# EAGLE design ife_19_TS_BMS_Testing (EAGLE 9.2.0)

## Sheet 1 of 5: Power
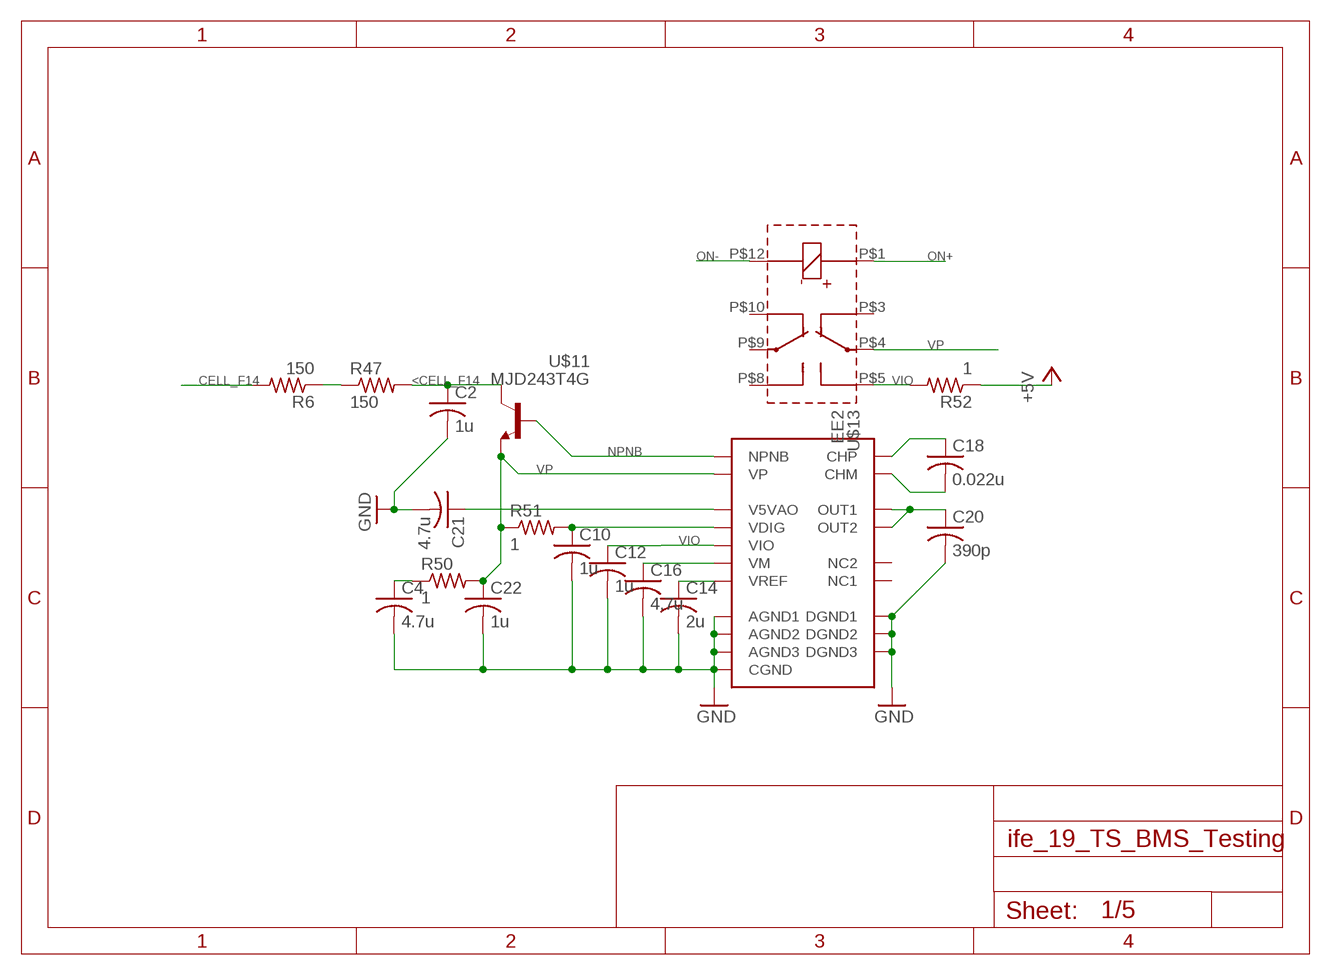
[diagram p0: schematic, sheet 1]

### Parts
C2  1u  C-USC0805  [C0805]
C4  4.7u  C-USC0805  [C0805]
C10  1u  C-USC0805  [C0805]
C12  1u  C-USC0805  [C0805]
C14  2u  C-USC0805  [C0805]
C16  4.7u  C-USC0805  [C0805]
C18  0.022u  C-USC0805  [C0805]
C20  390p  C-USC0805  [C0805]
C21  4.7u  C-USC0805  [C0805]
C22  1u  C-USC0805  [C0805]
R6  150  R-US_R2512  [R2512]
R47  150  R-US_R2512  [R2512]
R50  1  R-US_R0805  [R0805]
R51  1  R-US_R0805  [R0805]
R52  1  R-US_R0805  [R0805]
U$1  BQ76PL455A  [TQFP80]
U$11  MJD243T4G  [TO252]
U$13  EE2  [EE2-DPDT-SMD]

### Nets
<CELL_F14: C2.1 R47.2 U$11.4(C)
CELL_F14: R6.2 ; also sheet 2,5
GND: C2.2 C4.2 C10.2 C12.2 C14.2 C16.2 C20.2 C21.2 C22.2 U$1.30(DGND1) U$1.35(DGND2) U$1.37(DGND3) U$1.48(CGND) U$1.69(AGND3) U$1.72(AGND2) U$1.74(AGND1) ; also sheet 2,3,4,5
N$27: C4.1 R50.1
N$31: C10.1 R51.2 U$1.34(VDIG)
N$33: R52.2 U$13.P$5($P5)
N$35: C14.1 U$1.67(VREF)
N$37: C16.1 U$1.31(VM)
N$39: C21.1 U$1.58(V5VAO)
N$42: R6.1 R47.1
N$45: C18.1 U$1.32(CHP)
N$62: C18.2 U$1.33(CHM)
N$63: C20.1 U$1.68(OUT2) U$1.73(OUT1)
NPNB: U$1.71(NPNB) U$11.1(B)
ON+: U$13.P$1($P1) ; also sheet 3
ON-: U$13.P$12($P12) ; also sheet 3
VIO: C12.1 R52.1 U$1.41(VIO) ; supply symbol labelled +5V ; also sheet 4,5
VP: C22.1 R50.2 R51.1 U$1.70(VP) U$11.3(E) U$13.P$4($P4)
Unconnected: U$1.36(NC1) U$1.75(NC2) U$13.P$3($P3) U$13.P$8($P8) U$13.P$9($P9) U$13.P$10($P10)

## Sheet 2 of 5: Cells
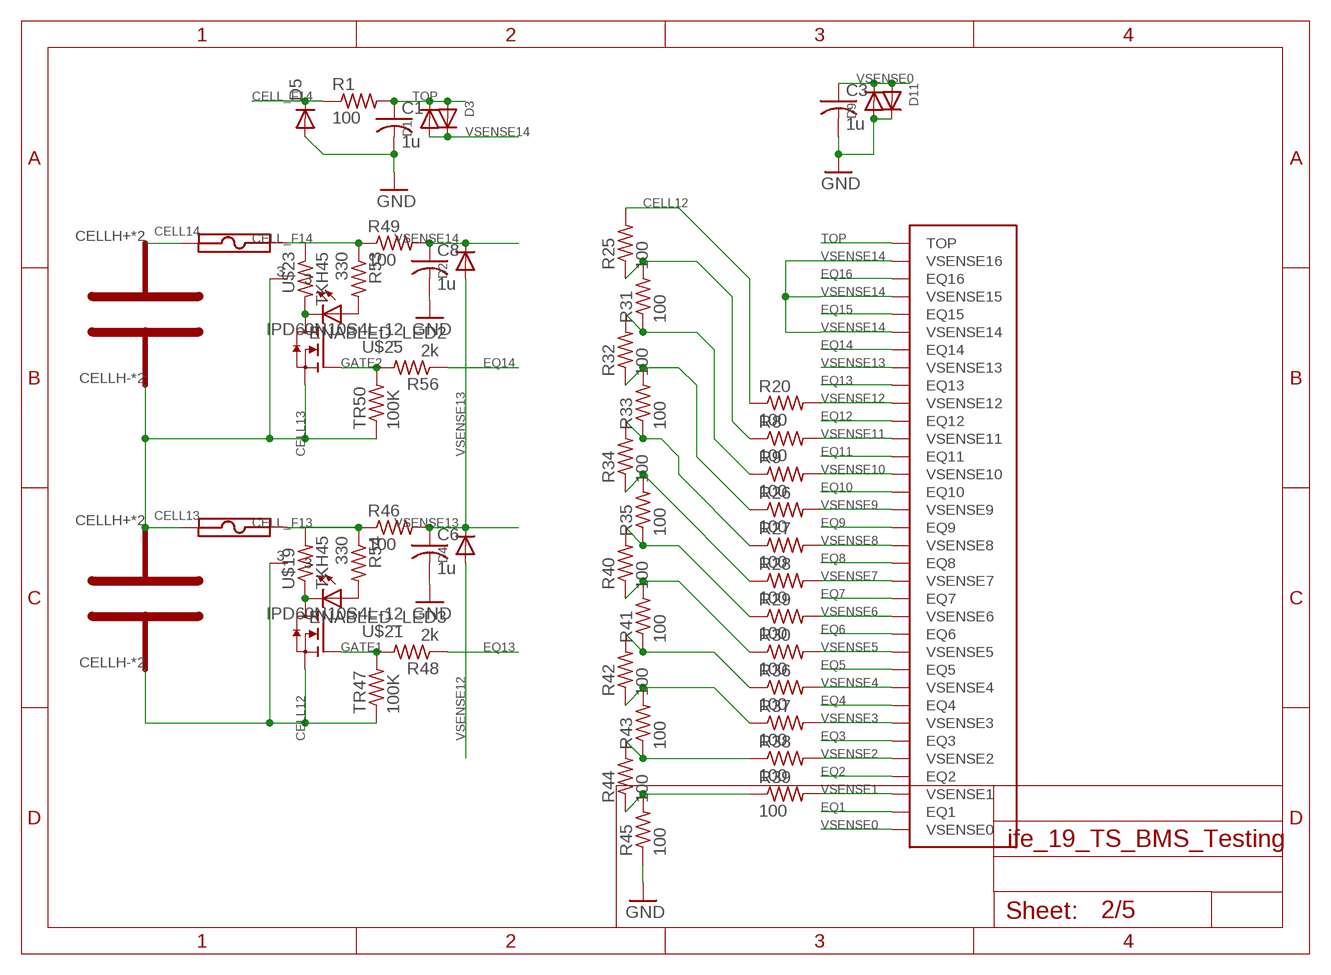
[diagram p1: schematic, sheet 2]

### Parts
13  LI6PT  [6PT]
14  LI6PT  [6PT]
C1  1u  C-USC0603K  [C0603K]
C3  1u  C-USC0603K  [C0603K]
C6  1u  C-USC0603K  [C0603K]
C8  1u  C-USC0603K  [C0603K]
D1  DIODESOD-123  [SOD-123]
D2  DIODESOD-123  [SOD-123]
D3  DIODESOD-123  [SOD-123]
D4  DIODESOD-123  [SOD-123]
D5  DIODE-DO214AC  [DO214AC]
D9  DIODESOD-123  [SOD-123]
D11  DIODESOD-123  [SOD-123]
ENABLED_LED2  LEDCHIPLED_0603  [CHIPLED_0603]
ENABLED_LED3  LEDCHIPLED_0603  [CHIPLED_0603]
R1  100  R-US_R0603  [R0603]
R8  100  R-US_R0603  [R0603]
R9  100  R-US_R0603  [R0603]
R20  100  R-US_R0603  [R0603]
R25  100  R-US_R0603  [R0603]
R26  100  R-US_R0603  [R0603]
R27  100  R-US_R0603  [R0603]
R28  100  R-US_R0603  [R0603]
R29  100  R-US_R0603  [R0603]
R30  100  R-US_R0603  [R0603]
R31  100  R-US_R0603  [R0603]
R32  100  R-US_R0603  [R0603]
R33  100  R-US_R0603  [R0603]
R34  100  R-US_R0603  [R0603]
R35  100  R-US_R0603  [R0603]
R36  100  R-US_R0603  [R0603]
R37  100  R-US_R0603  [R0603]
R38  100  R-US_R0603  [R0603]
R39  100  R-US_R0603  [R0603]
R40  100  R-US_R0603  [R0603]
R41  100  R-US_R0603  [R0603]
R42  100  R-US_R0603  [R0603]
R43  100  R-US_R0603  [R0603]
R44  100  R-US_R0603  [R0603]
R45  100  R-US_R0603  [R0603]
R46  100  R-US_R0603  [R0603]
R48  2k  R-US_R0603  [R0603]
R49  100  R-US_R0603  [R0603]
R53  330  R-US_R0603  [R0603]
R54  330  R-US_R0603  [R0603]
R56  2k  R-US_R0603  [R0603]
TR47  100K  R-US_R0603  [R0603]
TR50  100K  R-US_R0603  [R0603]
U$18  SF-0603FP  [0603]
U$19  TKH45  [TO252-TKH-45]
U$21  IPD60N10S4L-12  [TO252]
U$22  SF-0603FP  [0603]
U$23  TKH45  [TO252-TKH-45]
U$25  IPD60N10S4L-12  [TO252]

### Nets
CELL12: 13.CELLH-(CELL-) 13.CELLP-(CELL-) R20.1 R25.2 TR47.1 U$19.3 U$21.3(S) ; also sheet 4
CELL13: 13.CELLH+(CELL+) 13.CELLP+(CELL+) 14.CELLH-(CELL-) 14.CELLP-(CELL-) TR50.1 U$18.1 U$23.3 U$25.3(S)
CELL14: 14.CELLH+(CELL+) 14.CELLP+(CELL+) U$22.1
CELL_F13: R46.1 R54.1 U$18.2 U$19.2 ; also sheet 5
CELL_F14: D5.C R1.1 R49.1 R53.1 U$22.2 U$23.1 ; also sheet 1,5
EQ1: U$1.28(EQ1)
EQ2: U$1.26(EQ2)
EQ3: U$1.24(EQ3)
EQ4: U$1.22(EQ4)
EQ5: U$1.20(EQ5)
EQ6: U$1.18(EQ6)
EQ7: U$1.16(EQ7)
EQ8: U$1.14(EQ8)
EQ9: U$1.12(EQ9)
EQ10: U$1.10(EQ10)
EQ11: U$1.8(EQ11)
EQ12: U$1.6(EQ12)
EQ13: R48.1 U$1.4(EQ13)
EQ14: R56.1 U$1.2(EQ14)
EQ15: U$1.80(EQ15)
EQ16: U$1.78(EQ16)
GATE1: R48.2 TR47.2 U$21.1(G)
GATE2: R56.2 TR50.2 U$25.1(G)
GND: C1.2 C3.2 C6.2 C8.2 D5.A D9.A D11.C R45.1 ; also sheet 1,3,4,5
N$29: ENABLED_LED2.A R53.2
N$30: ENABLED_LED3.A R54.2
N$38: ENABLED_LED3.C U$19.1 U$21.2(D)
N$41: ENABLED_LED2.C U$23.2 U$25.2(D)
N$51: R8.1 R25.1 R31.2
N$52: R9.1 R31.1 R32.2
N$53: R26.1 R32.1 R33.2
N$54: R27.1 R33.1 R34.2
N$55: R28.1 R34.1 R35.2
N$56: R29.1 R35.1 R40.2
N$57: R30.1 R40.1 R41.2
N$58: R36.1 R41.1 R42.2
N$59: R37.1 R42.1 R43.2
N$60: R38.1 R43.1 R44.2
N$61: R39.1 R44.1 R45.2
TOP: C1.1 D1.C D3.A R1.2 U$1.76(TOP)
VSENSE0: C3.1 D9.C D11.A U$1.29(VSENSE0)
VSENSE1: R39.2 U$1.27(VSENSE1)
VSENSE2: R38.2 U$1.25(VSENSE2)
VSENSE3: R37.2 U$1.23(VSENSE3)
VSENSE4: R36.2 U$1.21(VSENSE4)
VSENSE5: R30.2 U$1.19(VSENSE5)
VSENSE6: R29.2 U$1.17(VSENSE6)
VSENSE7: R28.2 U$1.15(VSENSE7)
VSENSE8: R27.2 U$1.13(VSENSE8)
VSENSE9: R26.2 U$1.11(VSENSE9)
VSENSE10: R9.2 U$1.9(VSENSE10)
VSENSE11: R8.2 U$1.7(VSENSE11)
VSENSE12: D4.A R20.2 U$1.5(VSENSE12)
VSENSE13: C6.1 D2.A D4.C R46.2 U$1.3(VSENSE13)
VSENSE14: C8.1 D1.A D2.C D3.C R49.2 U$1.1(VSENSE14) U$1.77(VSENSE16) U$1.79(VSENSE15)

## Sheet 3 of 5: Differential communication
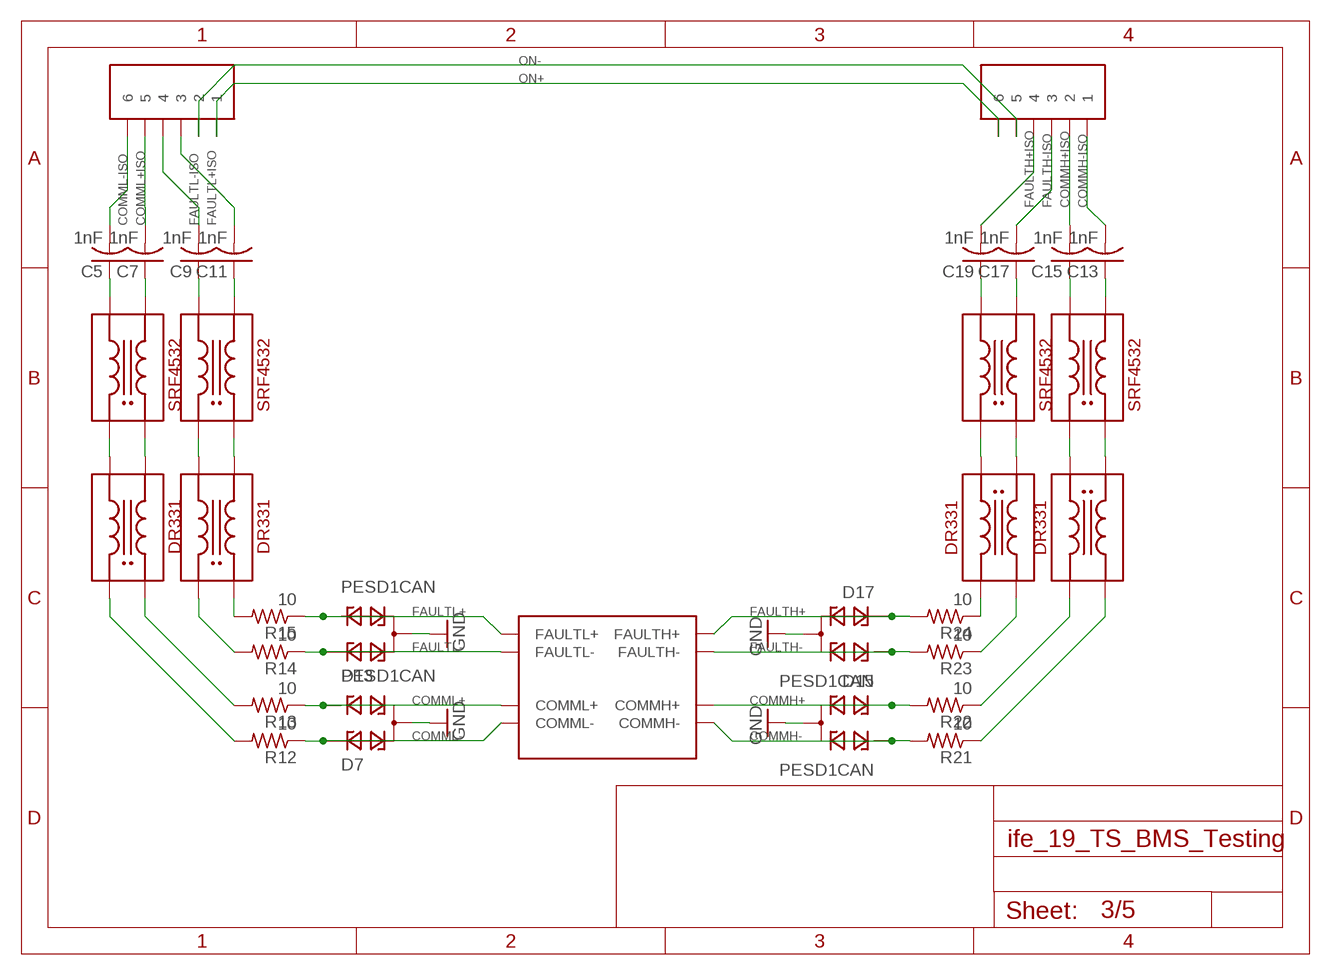
[diagram p2: schematic, sheet 3]

### Parts
C5  1nF  C-USC0805  [C0805]
C7  1nF  C-USC0805  [C0805]
C9  1nF  C-USC0805  [C0805]
C11  1nF  C-USC0805  [C0805]
C13  1nF  C-USC0805  [C0805]
C15  1nF  C-USC0805  [C0805]
C17  1nF  C-USC0805  [C0805]
C19  1nF  C-USC0805  [C0805]
D7  PESD1CAN  [SOT23]
D13  PESD1CAN  [SOT23]
D15  PESD1CAN  [SOT23]
D17  PESD1CAN  [SOT23]
R12  10  R-US_R0805  [R0805]
R13  10  R-US_R0805  [R0805]
R14  10  R-US_R0805  [R0805]
R15  10  R-US_R0805  [R0805]
R21  10  R-US_R0805  [R0805]
R22  10  R-US_R0805  [R0805]
R23  10  R-US_R0805  [R0805]
R24  10  R-US_R0805  [R0805]
U$2  SRF5432  [SRF5432]
U$3  SRF5432  [SRF5432]
U$4  SRF5432  [SRF5432]
U$5  MICROFIT3.0-3P  [6POS-3MM]
U$6  SRF5432  [SRF5432]
U$7  MICROFIT3.0-3P  [6POS-3MM]
U$10  DR331  [DR331]
U$12  DR331  [DR331]
U$14  DR331  [DR331]
U$16  DR331  [DR331]

### Nets
COMMH+: D15.1 R22.2 U$1.55(COMMH+)
COMMH+ISO: C15.2 U$7.P$2
COMMH-: D15.2 R21.2 U$1.54(COMMH-)
COMMH-ISO: C13.2 U$7.P$1
COMML+: D7.2 R13.1 U$1.52(COMML+)
COMML+ISO: C7.2 U$5.P$5
COMML-: D7.1 R12.1 U$1.53(COMML-)
COMML-ISO: C5.2 U$5.P$6
FAULTH+: D17.1 R24.2 U$1.57(FAULTH+)
FAULTH+ISO: C19.2 U$7.P$4
FAULTH-: D17.2 R23.2 U$1.56(FAULTH-)
FAULTH-ISO: C17.2 U$7.P$3
FAULTL+: D13.2 R15.1 U$1.50(FAULTL+)
FAULTL+ISO: C11.2 U$5.P$3
FAULTL-: D13.1 R14.1 U$1.51(FAULTL-)
FAULTL-ISO: C9.2 U$5.P$4
GND: D7.3 D13.3 D15.3 D17.3 ; also sheet 1,2,4,5
N$1: C5.1 U$2.P$3
N$2: C7.1 U$2.P$2
N$3: C9.1 U$3.P$3
N$4: C11.1 U$3.P$2
N$7: C13.1 U$6.P$2
N$8: C15.1 U$6.P$3
N$9: C17.1 U$4.P$2
N$10: C19.1 U$4.P$3
N$11: U$6.P$4 U$14.P$2
N$12: U$6.P$1 U$14.P$1
N$13: U$4.P$4 U$16.P$2
N$14: U$4.P$1 U$16.P$1
N$15: U$2.P$1 U$10.P$3
N$16: U$2.P$4 U$10.P$4
N$17: U$3.P$1 U$12.P$3
N$18: U$3.P$4 U$12.P$4
N$19: R14.2 U$12.P$1
N$20: R13.2 U$10.P$2
N$21: R12.2 U$10.P$1
N$22: R15.2 U$12.P$2
N$23: R23.1 U$16.P$4
N$24: R22.1 U$14.P$3
N$25: R21.1 U$14.P$4
N$26: R24.1 U$16.P$3
ON+: U$5.P$1 U$7.P$6 ; also sheet 1
ON-: U$5.P$2 U$7.P$5 ; also sheet 1

## Sheet 4 of 5: Communication
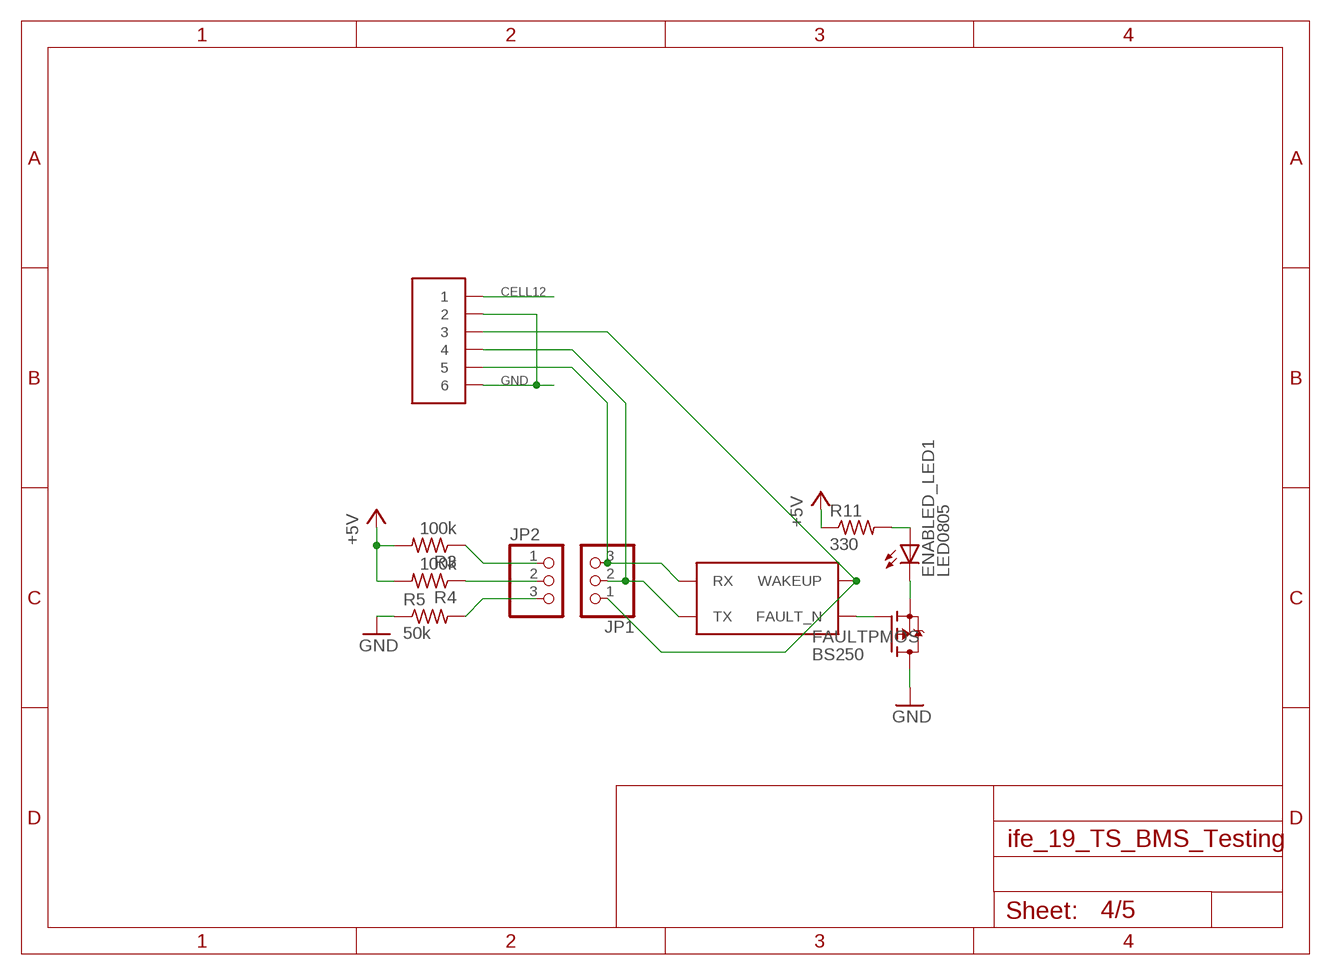
[diagram p3: schematic, sheet 4]

### Parts
ENABLED_LED1  LED0805  [LED0805]
FAULTPMOS  BS250  [SOT23]
JP1  PINHD-1X3CB  [1X03-CLEANBIG]
JP2  PINHD-1X3CB  [1X03-CLEANBIG]
R3  100k  R-US_R0805  [R0805]
R4  100k  R-US_R0805  [R0805]
R5  50k  R-US_R0805  [R0805]
R11  330  R-US_R0805  [R0805]
U$9  MICROFIT3.0-3P  [6POS-3MM]

### Nets
CELL12: U$9.P$1 ; also sheet 2
FAULT_N: FAULTPMOS.1(G) U$1.40(FAULT_N)
GND: FAULTPMOS.3(D) R5.1 U$9.P$2 U$9.P$6 ; also sheet 1,2,3,5
N$5: ENABLED_LED1.2(C) FAULTPMOS.2(S)
N$6: ENABLED_LED1.1(A) R11.2
N$28: JP2.1 R3.1
N$34: JP1.3 U$1.39(RX) U$9.P$5
N$40: JP2.2 R4.1
N$43: JP2.3 R5.2
N$44: JP1.2 U$1.38(TX) U$9.P$4
N$46: JP1.1 U$1.49(WAKEUP) U$9.P$3
VIO: R3.2 R4.2 R11.1 ; supply symbol labelled +5V ; also sheet 1,5

## Sheet 5 of 5: GPIO
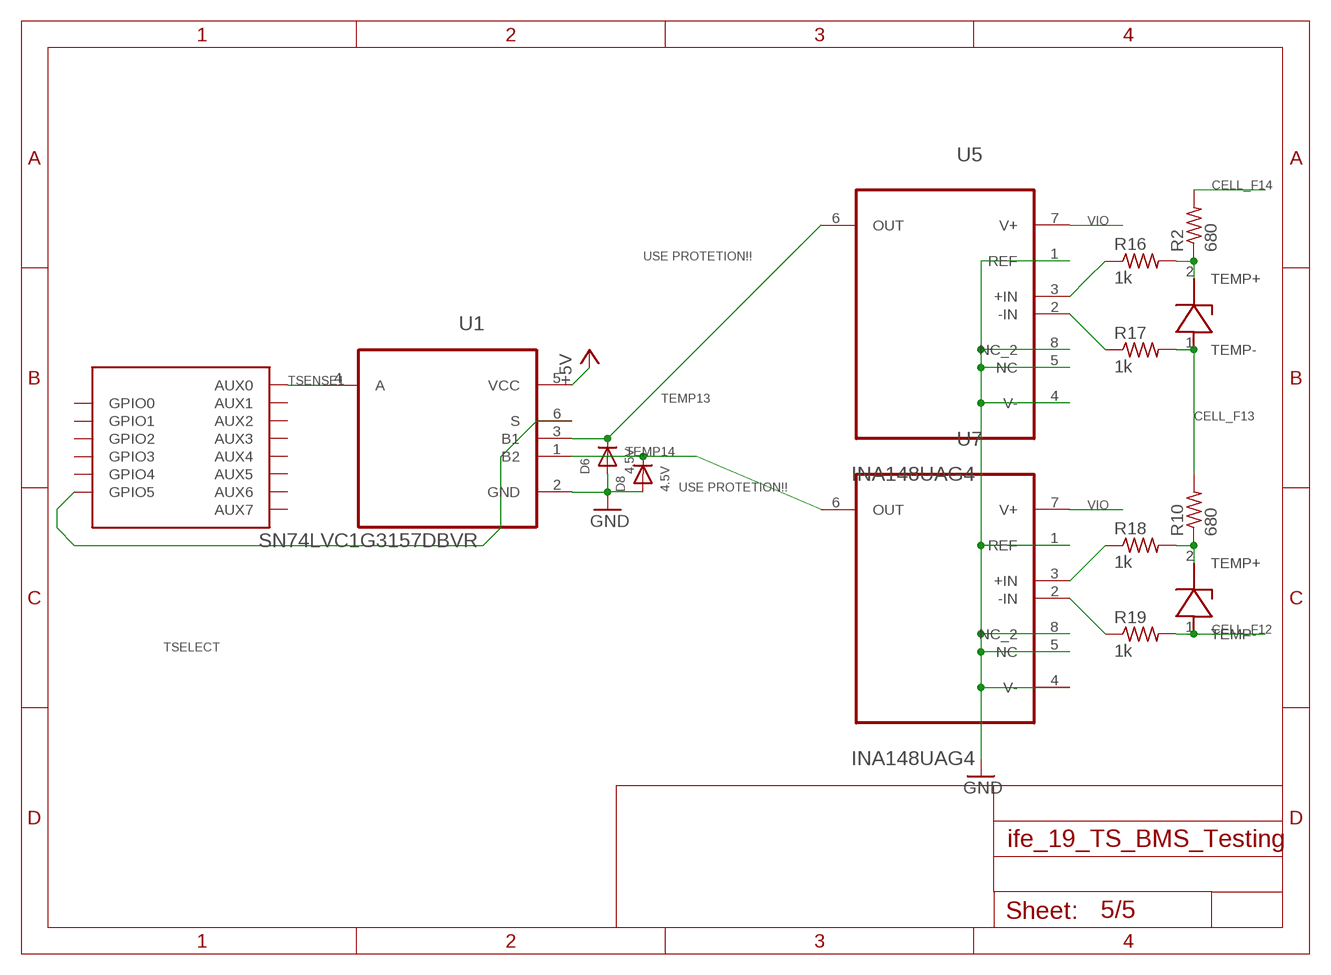
[diagram p4: schematic, sheet 5]

### Parts
D6  4.5V  DIODESOD-123  [SOD-123]
D8  4.5V  DIODESOD-123  [SOD-123]
R2  680  R-US_R0603  [R0603]
R10  680  R-US_R0603  [R0603]
R16  1k  R-US_R0603  [R0603]
R17  1k  R-US_R0603  [R0603]
R18  1k  R-US_R0603  [R0603]
R19  1k  R-US_R0603  [R0603]
U1  SN74LVC1G3157DBVR  [SOT95P280X145-6N]
U5  INA148UAG4  [SOIC127P600X175-8N]
U7  INA148UAG4  [SOIC127P600X175-8N]

### Nets
CELL_F12: 13.1(TEMP-) R19.2
CELL_F13: 14.1(TEMP-) R10.2 R17.2 ; also sheet 2
CELL_F14: R2.2 ; also sheet 1,2
GND: D6.A D8.A U1.2(GND) U5.1(REF) U5.4(V-) U5.5(NC) U5.8(NC_2) U7.1(REF) U7.4(V-) U7.5(NC) U7.8(NC_2) ; also sheet 1,2,3,4
N$32: R16.1 U5.3(+IN)
N$36: R18.1 U7.3(+IN)
N$47: R17.1 U5.2(-IN)
N$48: 14.2(TEMP+) R2.1 R16.2
N$49: 13.2(TEMP+) R10.1 R18.2
N$50: R19.1 U7.2(-IN)
TEMP13: D6.C U1.3(B1) U5.6(OUT)
TEMP14: D8.C U1.1(B2) U7.6(OUT)
TSELECT: U1.6(S) U$1.42(GPIO5)
TSENSE1: U1.4(A) U$1.66(AUX0)
VIO: U1.5(VCC) U5.7(V+) U7.7(V+) ; supply symbol labelled +5V ; also sheet 1,4
Unconnected: U$1.43(GPIO4) U$1.44(GPIO3) U$1.45(GPIO2) U$1.46(GPIO1) U$1.47(GPIO0) U$1.59(AUX7) U$1.60(AUX6) U$1.61(AUX5) U$1.62(AUX4) U$1.63(AUX3) U$1.64(AUX2) U$1.65(AUX1)

### Notes on the sheet
- USE PROTETION!!
- USE PROTETION!!

## Library data of the parts
13 14 = IFE_Energus:LI6PT
C1-C22 = rcl:C-US: CAPACITOR, American symbol; SPICEPREFIX: C
D1-D4 D6 D8 D9 D11 = adafruit:DIODE: Diode SMADIODE - SMA Surface Mount Package 20V 1A Schottky Diode Digikey: 641-1014-6-ND DO-1N4148 - Through Hole Small Current Diode SOD-123 20V 1 A (.5mV Vf) Schottky Diode - Digikey: MBRX120TPMSCT-ND SOD-323 10V 570mA (.38mV Vf, 3ns) Schottky Diode - Digikey: ZLLS410CT-ND SOD-523 30V 30mA Schottky Diode (RB751S-40TE61) - Digikey: RB751S-40TE61CT-ND SOT23-R/W - SOT23 Package (R = Solder Paste/Reflow Ovens, W = Hand-Soldering) BAT54Film 40V 300mA - Digikey: 497-7162-1-ND
D5 = diode:DIODE-: DIODE
D7 D13 D15 D17 = diode:PESD1CAN: CAN bus ESD protection diode Source: http://www.nxp.com/documents/data_sheet/PESD1CAN.pdf
ENABLED_LED1 = LEDS:LED0805
ENABLED_LED2 ENABLED_LED3 = led:LED: LED OSRAM: - CHIPLED LG R971, LG N971, LY N971, LG Q971, LY Q971, LO R971, LY R971 LH N974, LH R974 LS Q976, LO Q976, LY Q976 LO Q996 - Hyper CHIPLED LW Q18S LB Q993, LB Q99A, LB R99A - SideLED LS A670, LO A670, LY A670, LG A670, LP A670 LB A673, LV A673, LT A673, LW A673 LH A674 LY A675 LS A676, LA A676, LO A676, LY A676, LW A676 LS A679, LY A679, LG A679 - Hyper Micro SIDELED® LS Y876, LA Y876, LO Y876, LY Y876 LT Y87S - SmartLED LW L88C, LW L88S LB L89C, LB L89S, LG L890 LS L89K, LO L89K, LY L89K LS L896, LA L896, LO L896, LY L896 - TOPLED LS T670, LO T670, LY T670, LG T670, LP T670 LSG T670, LSP T670, LSY T670, LOP T670, LYG T670 LG T671, LOG T671, LSG T671 LB T673, LV T673, LT T673, LW T673 LH T674 LS T676, LA T676, LO T676, LY T676, LB T676, LH T676, LSB T676, LW T676 LB T67C, LV T67C, LT T67C, LS T67K, LO T67K, LY T67K, LW E67C LS E67B, LA E67B, LO E67B, LY E67B, LB E67C, LV E67C, LT E67C LW T67C LS T679, LY T679, LG T679 LS T770, LO T770, LY T770, LG T770, LP T770 LB T773, LV T773, LT T773, LW T773 LH T774 LS E675, LA E675, LY E675, LS T675 LS T776, LA T776, LO T776, LY T776, LB T776 LHGB T686 LT T68C, LB T68C - Hyper Mini TOPLED® LB M676 - Mini TOPLED Santana® LG M470 LS M47K, LO M47K, LY M47K Source: http://www.osram.convergy.de LUXEON: - LUMILED® LXK2-PW12-R00, LXK2-PW12-S00, LXK2-PW14-U00, LXK2-PW14-V00 LXK2-PM12-R00, LXK2-PM12-S00, LXK2-PM14-U00 LXK2-PE12-Q00, LXK2-PE12-R00, LXK2-PE12-S00, LXK2-PE14-T00, LXK2-PE14-U00 LXK2-PB12-K00, LXK2-PB12-L00, LXK2-PB12-M00, LXK2-PB14-N00, LXK2-PB14-P00, LXK2-PB14-Q00 LXK2-PR12-L00, LXK2-PR12-M00, LXK2-PR14-Q00, LXK2-PR14-R00 LXK2-PD12-Q00, LXK2-PD12-R00, LXK2-PD12-S00 LXK2-PH12-R00, LXK2-PH12-S00 LXK2-PL12-P00, LXK2-PL12-Q00, LXK2-PL12-R00 Source: www.luxeon.com KINGBRIGHT: KA-3528ASYC Source: www.kingbright.com
FAULTPMOS = TRANS:BS250: BS250FTA P-Channel Vgs(th) = 3.5V, Rds(on) = 14 ohm, Vds(max) = 45V
JP1 JP2 = adafruit:PINHD-1X3: PIN HEADER
R1-R6 R8-R54 R56 TR47 TR50 = rcl:R-US_: RESISTOR, American symbol; SPICEPREFIX: R
U1 = Texas Instruments_By_element14_Batch_1:SN74LVC1G3157DBVR: SINGLE-POLE, DOUBLE-THROW ANALOG SWITCH; MPN: SN74LVC1G3157DBVR; OC_FARNELL: 1470910; OC_NEWARK: 32H6364; PACKAGE: SOT-23-6; SUPPLIER: Texas Instruments
U5 U7 = Texas Instruments_By_element14_Batch_1:INA148UAG4: DIFFERENCE AMPLIFIER; MPN: INA148UAG4; OC_FARNELL: 1206902; OC_NEWARK: 97K1927; PACKAGE: SOIC-8; SUPPLIER: TI
U$1 = bq76pl455a:BQ76PL455A
U$2-U$4 U$6 = Chokes:SRF5432
U$5 U$7 U$9 = Molex:MICROFIT3.0-3P
U$10 U$12 U$14 U$16 = Chokes:DR331
U$11 = ONSemi:MJD243
U$13 = KEMET:EE2
U$18 U$22 = IFE_Fuses:SF-0603FP
U$19 U$23 = IFE_Resistors:TKH45
U$21 U$25 = IFE_Transistors:IPD60N10S4L-12

## Board
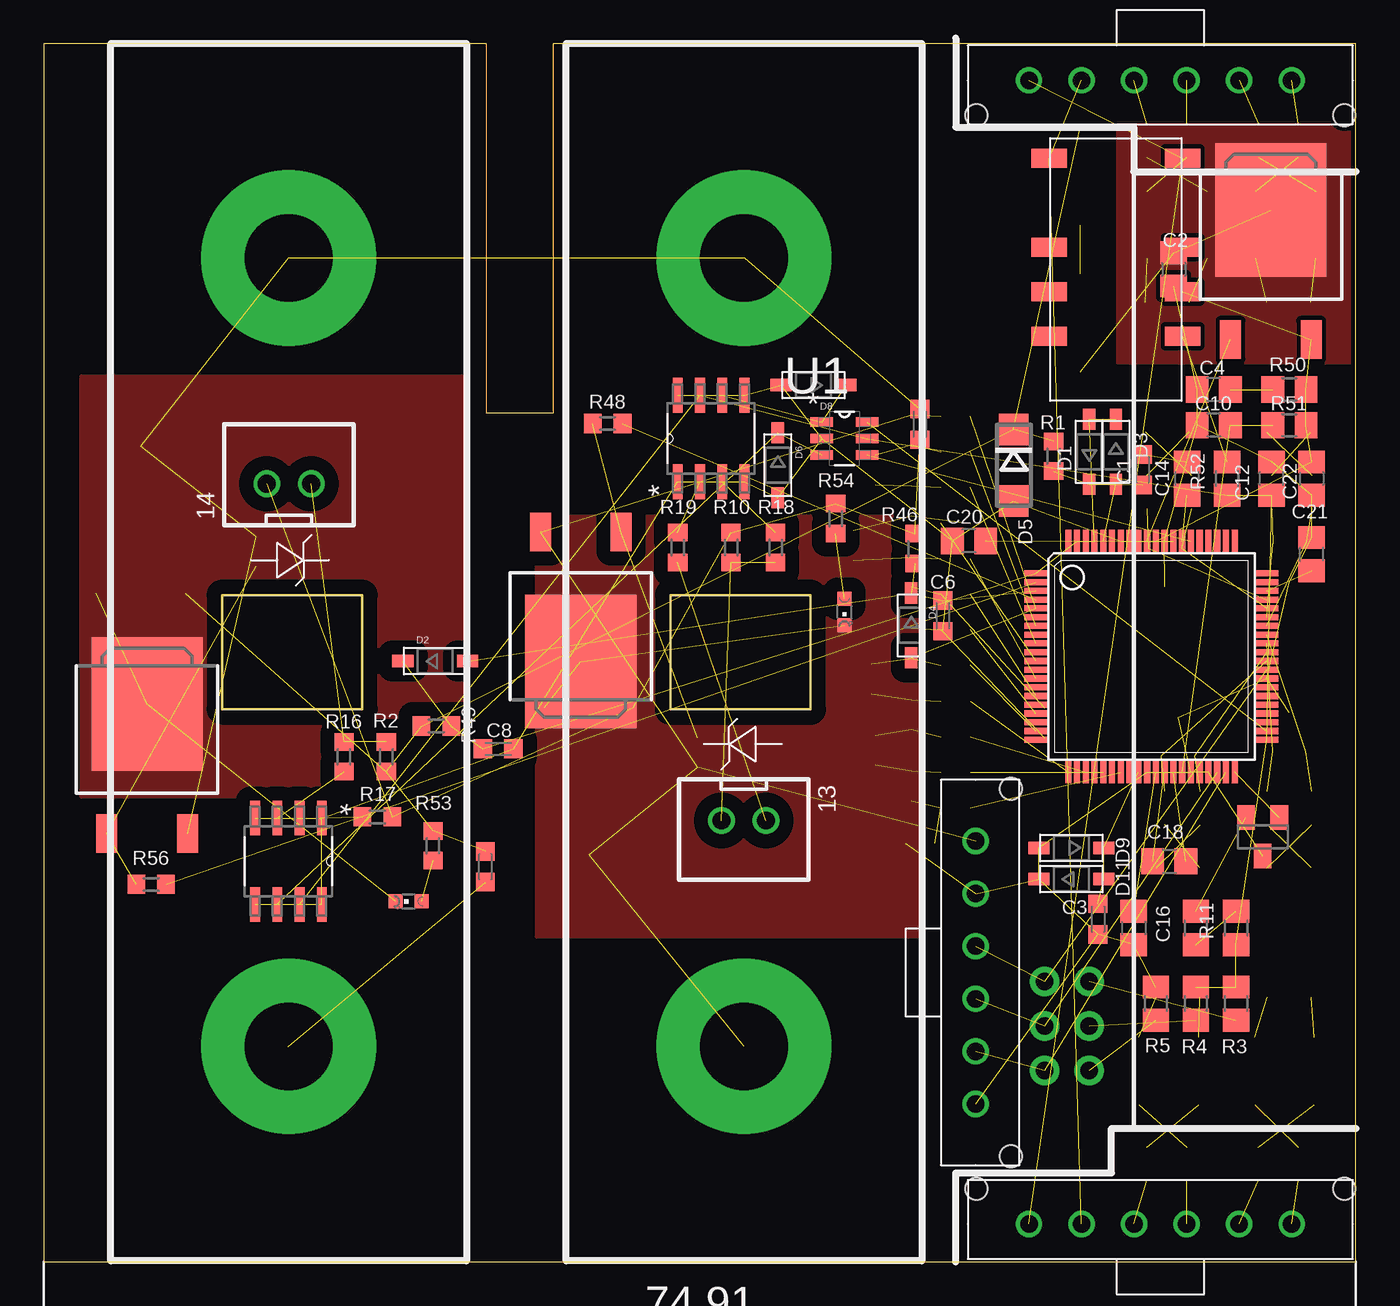
[diagram p5: board, top side]
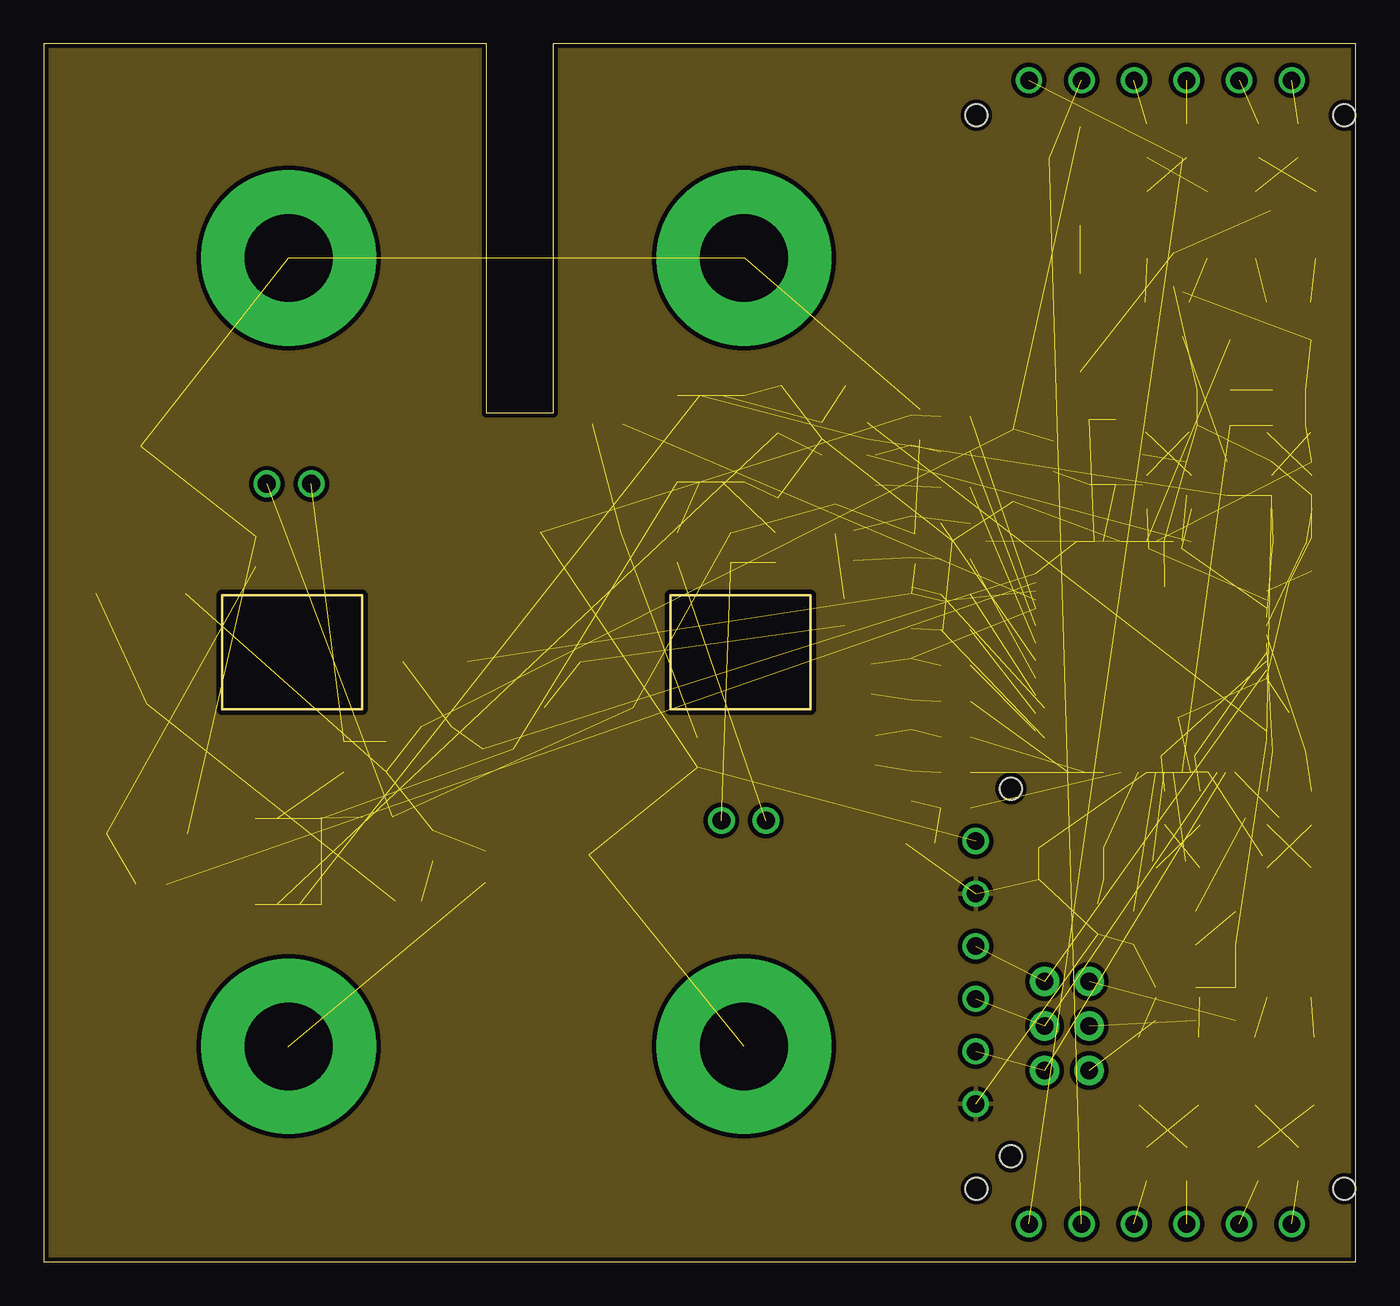
[diagram p6: board, inner layer Route15]
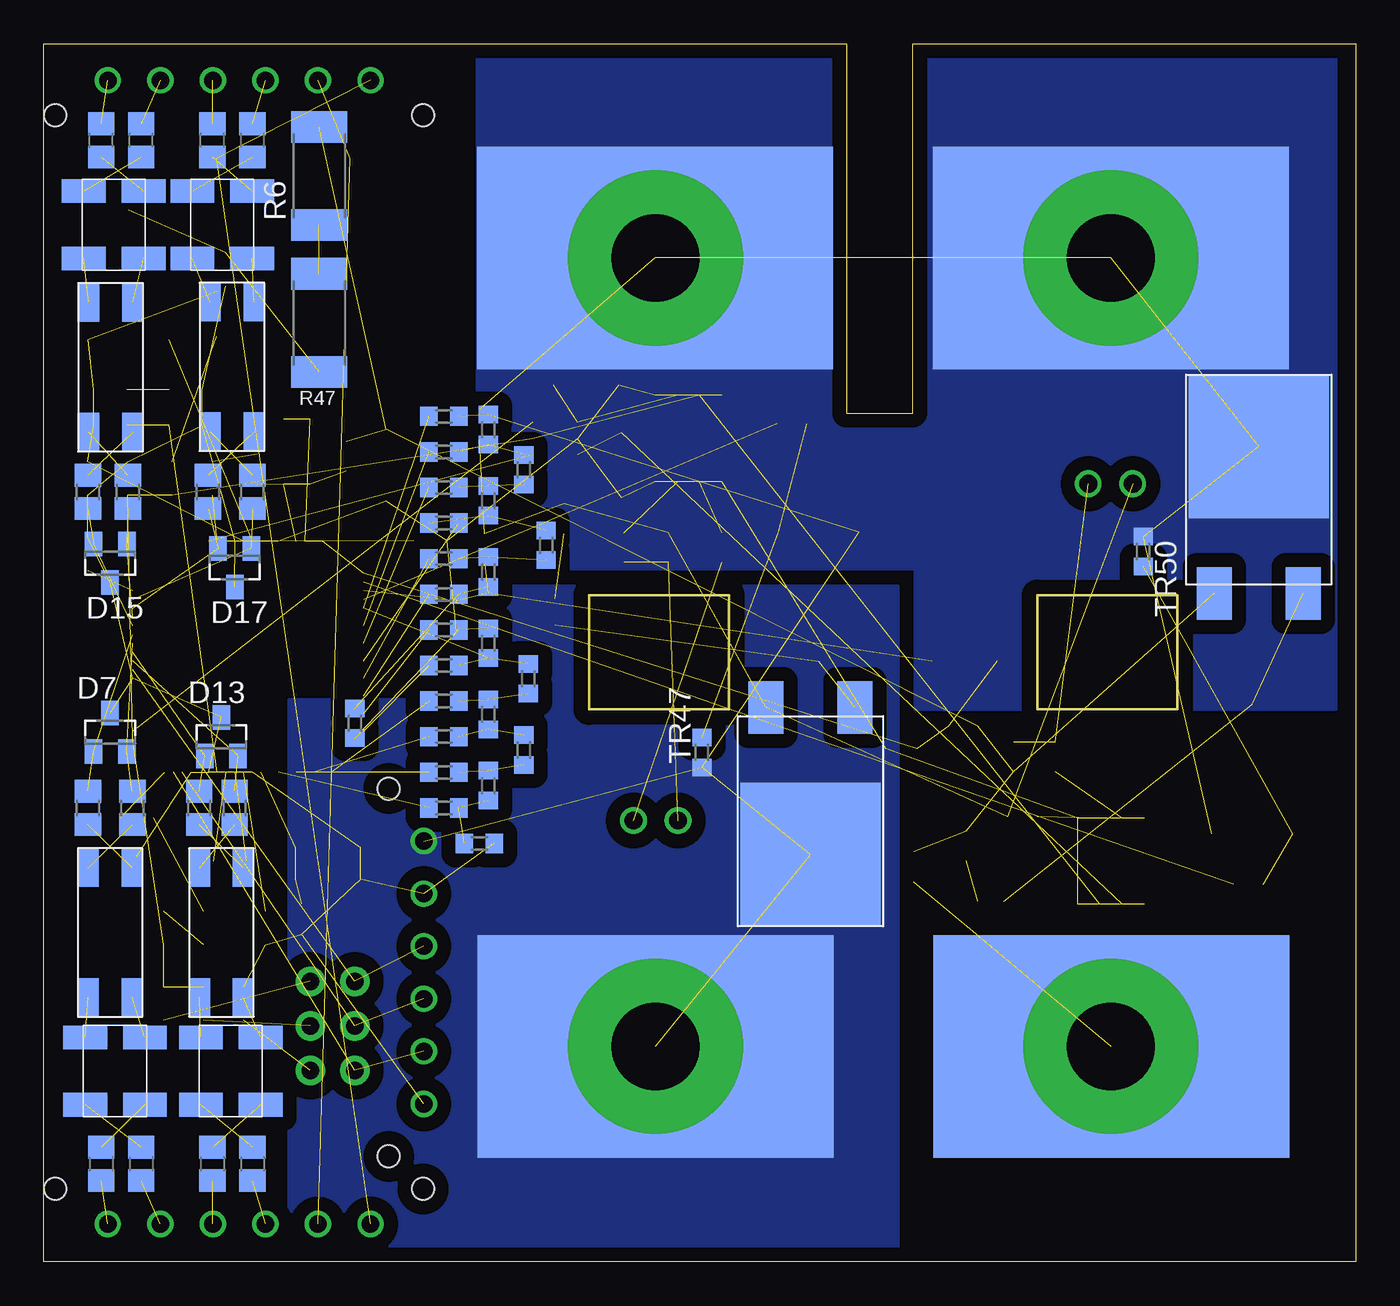
[diagram p7: board, bottom side, seen from below]

Size 74.91 x 69.52 mm. Coordinates in mm from the lower left corner, seen from the top.
Outline: 0,0 74.91,0 74.91,69.52 29.08,69.52 29.08,48.44 25.27,48.44 25.27,69.52 0,69.52 0,0
Copper layers (1+2+15+16): Top 0.035mm / dielectric 0.5mm / Route2 0.017mm / dielectric 0.5mm / Route15 0.017mm / dielectric 0.5mm / Bottom 0.035mm
Design rules "JLC_4layer": minimum track width 3.5mil, minimum drill 0.2mm, track to track 3.5mil, track to pad 3.5mil, pad to pad 3.5mil, via to via 5mil, smd to smd 3.5mil, copper to edge 8mil, drill to drill 6mil, minimum pad ring 3mil, minimum via ring 3mil, stop-mask expansion 4mil, vias tented up to drill 0mil, thermal gap 10mil

### Footprints (pad centres in the part's own frame; a part is rotated, then mirrored left to right if it is on the bottom)
6PT = drill 1.016: 1 8.9,44.36; 2 11.44,44.36 | drill 5 pad 10: CELLH+ 10.15,12.25; CELLH- 10.15,57.25 | smd 20.32 x 12.7 bottom: CELLP+ 10.135,12.243; CELLP- 10.16,57.252
C0603K = smd 1.05 x 1.08: 1 -0.875,0; 2 0.875,0
C0805 = smd 1.3 x 1.5: 1 -0.95,0; 2 0.95,0
SOD-123 = smd 1.2 x 0.7: A 1.85,0; C -1.85,0
DO214AC = smd 1.8 x 1.7: A 2.05,0; C -2.05,0
SOT23 = smd 1 x 1.4: 1 -0.95,-1.1; 2 0.95,-1.1; 3 0,1.1
LED0805 = smd 1.3 x 1.5: 1 -0.95,0; 2 0.95,0
CHIPLED_0603 = smd 0.8 x 0.8: A 0,-0.75; C 0,0.75
1X03-CLEANBIG = drill 1.016 pad 1.676: 1 -2.54,0; 2 0,0; 3 2.54,0
R0603 = smd 1 x 1.1: 1 -0.85,0; 2 0.85,0
R0805 = smd 1.3 x 1.5: 1 -0.95,0; 2 0.95,0
R2512 = smd 1.8 x 3.2: 1 -2.8,0; 2 2.8,0
SOT95P280X145-6N = smd 1.27 x 0.559: 1 -1.295,0.94; 2 -1.295,0; 3 -1.295,-0.94; 4 1.295,-0.94; 5 1.295,0; 6 1.295,0.94
SOIC127P600X175-8N = smd 1.981 x 0.559: 1 -2.464,1.905; 2 -2.464,0.635; 3 -2.464,-0.635; 4 -2.464,-1.905; 5 2.464,-1.905; 6 2.464,-0.635; 7 2.464,0.635; 8 2.464,1.905
TQFP80 = smd 1.3 x 0.35: 1 -6.595,4.75; 2 -6.595,4.25; 3 -6.595,3.75; 4 -6.595,3.25; 5 -6.595,2.75; 6 -6.595,2.25; 7 -6.595,1.75; 8 -6.595,1.25; 9 -6.595,0.75; 10 -6.595,0.25; 11 -6.595,-0.25; 12 -6.595,-0.75; 13 -6.595,-1.25; 14 -6.595,-1.75; 15 -6.595,-2.25; 16 -6.595,-2.75; 17 -6.595,-3.25; 18 -6.595,-3.75; 19 -6.595,-4.25; 20 -6.595,-4.75; 41 6.595,-4.75; 42 6.595,-4.25; 43 6.595,-3.75; 44 6.595,-3.25; 45 6.595,-2.75; 46 6.595,-2.25; 47 6.595,-1.75; 48 6.595,-1.25; 49 6.595,-0.75; 50 6.595,-0.25; 51 6.595,0.25; 52 6.595,0.75; 53 6.595,1.25; 54 6.595,1.75; 55 6.595,2.25; 56 6.595,2.75; 57 6.595,3.25; 58 6.595,3.75; 59 6.595,4.25; 60 6.595,4.75 | smd 0.35 x 1.3: 21 -4.75,-6.595; 22 -4.25,-6.595; 23 -3.75,-6.595; 24 -3.25,-6.595; 25 -2.75,-6.595; 26 -2.25,-6.595; 27 -1.75,-6.595; 28 -1.25,-6.595; 29 -0.75,-6.595; 30 -0.25,-6.595; 31 0.25,-6.595; 32 0.75,-6.595; 33 1.25,-6.595; 34 1.75,-6.595; 35 2.25,-6.595; 36 2.75,-6.595; 37 3.25,-6.595; 38 3.75,-6.595; 39 4.25,-6.595; 40 4.75,-6.595; 61 4.75,6.595; 62 4.25,6.595; 63 3.75,6.595; 64 3.25,6.595; 65 2.75,6.595; 66 2.25,6.595; 67 1.75,6.595; 68 1.25,6.595; 69 0.75,6.595; 70 0.25,6.595; 71 -0.25,6.595; 72 -0.75,6.595; 73 -1.25,6.595; 74 -1.75,6.595; 75 -2.25,6.595; 76 -2.75,6.595; 77 -3.25,6.595; 78 -3.75,6.595; 79 -4.25,6.595; 80 -4.75,6.595
SRF5432 = smd 1.35 x 2.5: P$1 -1.885,-1.679; P$2 1.955,-1.679; P$3 1.955,1.731; P$4 -1.885,1.731
6POS-3MM = drill 1: P$1 7.5,0; P$2 4.5,0; P$3 1.5,0; P$4 -1.5,0; P$5 -4.5,0; P$6 -7.5,0 | hole 1.27: -10.5,-2; 10.5,-2
DR331 = smd 2.2 x 1.2: P$1 -3.7,1.25; P$2 -3.7,-1.25; P$3 3.7,-1.25; P$4 3.7,1.25
TO252 = smd 1.2 x 2.2: 1 -2.342,-7.314; 3 2.258,-7.314 | smd 6.35 x 7.62: 4 -0.042,0.086
EE2-DPDT-SMD = smd 1.1 x 2: P$1 -6.35,3.81; P$3 -1.27,3.81; P$4 1.27,3.81; P$5 3.81,3.81; P$8 3.81,-3.81; P$9 1.27,-3.81; P$10 -1.27,-3.81; P$12 -6.35,-3.81
0603 = smd 1.05 x 1.08: 1 -0.875,0; 2 0.875,0
TO252-TKH-45 = smd 2 x 3: 1 -2.55,-12.5; 2 2.55,-12.5 | smd 8 x 8.2: 3 0,-4.1
TO252' = smd 1.2 x 2.2: 1 -2.279,-7.409; 3 2.321,-7.409 | smd 6.35 x 7.62: 2 0.021,-0.009

### Placement (x,y rotation side)
13  50.13,69.54 180 top
14  3.83,0.04 0 top
C1  62.74,45.21 90 top
C2  64.52,56.64 270 top
C3  60.2,19.56 270 top
C4  66.8,49.78 180 top
C5  71.63,5.59 270 bottom
C6  51.33,36.86 270 top
C7  69.34,5.59 270 bottom
C8  25.94,29.27 0 top
C9  65.28,5.59 270 bottom
C10  66.8,47.75 180 top
C11  62.99,5.59 270 bottom
C12  70.1,44.7 90 top
C13  71.63,64.01 90 bottom
C14  65.28,44.7 90 top
C15  69.34,64.01 90 bottom
C16  62.23,19.05 270 top
C17  65.28,64.01 90 bottom
C18  64.26,22.86 0 top
C19  62.99,64.01 90 bottom
C20  52.83,41.15 180 top
C21  72.39,40.39 90 top
C22  72.39,44.7 270 top
D1  59.69,46.23 90 top
D2  22.35,34.29 0 top
D3  61.21,46.23 270 top
D4  49.53,36.32 270 top
D5  55.37,45.47 270 top
D6  41.91,45.47 270 top
D7  71.12,30.23 0 bottom
D8  43.94,50.04 180 top
D9  58.67,23.62 180 top
D11  58.67,21.84 0 top
D13  64.77,29.97 0 bottom
D15  71.12,39.88 180 bottom
D17  64.01,39.62 180 bottom
ENABLED_LED1  65.79,19.05 90 top
ENABLED_LED2  20.83,20.57 90 top
ENABLED_LED3  45.72,37.08 180 top
FAULTPMOS  69.6,24.26 180 top
JP1  57.15,13.46 270 top
JP2  59.69,13.46 270 top
R1  57.66,45.97 270 top
R2  19.56,28.83 270 top
R3  68.07,14.73 90 top
R4  65.79,14.73 90 top
R5  63.5,14.73 270 top
R6  59.18,61.98 90 bottom
R8  52.07,46.23 180 bottom
R9  52.07,44.2 180 bottom
R10  39.24,40.77 90 top
R11  68.07,19.05 90 top
R12  72.39,25.91 270 bottom
R13  69.85,25.91 270 bottom
R14  66.04,25.91 270 bottom
R15  64.01,25.91 270 bottom
R16  17.14,28.83 90 top
R17  19.05,25.4 0 top
R18  41.78,40.77 270 top
R19  36.2,40.77 270 top
R20  52.07,48.26 180 bottom
R21  72.39,43.94 270 bottom
R22  70.1,43.94 270 bottom
R23  65.53,43.94 270 bottom
R24  62.99,43.94 270 bottom
R25  49.53,47.5 90 bottom
R26  52.07,42.16 0 bottom
R27  52.07,40.13 180 bottom
R28  52.07,38.1 180 bottom
R29  52.07,36.07 180 bottom
R30  52.07,34.04 180 bottom
R31  47.5,45.21 90 bottom
R32  49.53,43.43 90 bottom
R33  46.23,40.89 90 bottom
R34  49.53,39.37 90 bottom
R35  57.15,30.73 90 bottom
R36  52.07,32 180 bottom
R37  52.07,29.97 180 bottom
R38  52.07,27.94 180 bottom
R39  52.07,25.91 180 bottom
R40  49.53,35.31 90 bottom
R41  47.24,33.27 90 bottom
R42  49.53,31.24 90 bottom
R43  47.5,29.21 90 bottom
R44  49.53,27.18 90 bottom
R45  50.04,23.88 180 bottom
R46  49.74,40.71 270 top
R47  59.18,53.59 270 bottom
R48  32.2,47.84 180 top
R49  22.42,30.58 0 top
R50  71.12,49.78 0 top
R51  71.12,47.75 180 top
R52  67.56,44.7 90 top
R53  22.23,23.75 270 top
R54  45.21,42.42 270 top
R56  6.13,21.54 180 top
TR47  37.33,29.07 90 bottom
TR50  12.13,40.54 270 bottom
U1  45.72,46.99 0 top
U5  13.97,22.86 270 top
U7  38.1,46.99 90 top
U$1  63.25,34.54 0 top
U$2  70.87,10.92 270 bottom
U$3  64.26,10.92 270 bottom
U$4  64.69,59.16 90 bottom
U$5  63.75,2.16 180 top
U$6  70.89,59.16 90 bottom
U$7  63.75,67.44 0 top
U$9  53.21,16.51 90 top
U$10  71.12,18.8 270 bottom
U$11  70.1,59.94 0 top
U$12  64.77,18.8 270 bottom
U$13  61.21,56.64 270 top
U$14  71.09,51.05 270 bottom
U$16  64.16,51.08 270 bottom
U$18  50.02,47.79 270 top
U$19  31.13,19.14 180 bottom
U$21  IPD60N10S4L-12  [TO252']  30.68,34.24 180 top
U$22  25.21,22.54 90 top
U$23  5.53,50.64 0 bottom
U$25  IPD60N10S4L-12  [TO252']  5.88,31.84 0 top

### Tracks (layer width: path | path; a pad name or v marks a point on that pad's centre or on a via)
<CELL_F14  (2 unrouted)
  pour Top (isolate 0.254, no thermals): 61.34,64.9 74.93,64.9 74.93,51.31 61.34,51.31
CELL12  (7 unrouted)
  pour Bottom (isolate 0.813, no thermals): 26.13,-0.46 26.13,38.54 50.13,38.54 50.13,32.07 60.91,32.07 60.91,-0.46
CELL13  (7 unrouted)
  pour Bottom (isolate 0.813, no thermals): 1.13,39.54 1.13,31.54 25.13,31.54 25.13,39.54 50.13,39.54 50.13,70.54 1.13,70.54
CELL14  (2 unrouted)
CELL_F12  (1 unrouted)
CELL_F13  (6 unrouted)
CELL_F14  (7 unrouted)
COMMH+  (2 unrouted)
COMMH+ISO  (1 unrouted)
COMMH-  (2 unrouted)
COMMH-ISO  (1 unrouted)
COMML+  (2 unrouted)
COMML+ISO  (1 unrouted)
COMML-  (2 unrouted)
COMML-ISO  (1 unrouted)
EQ13  (1 unrouted)
EQ14  (1 unrouted)
FAULT_N  (1 unrouted)
FAULTH+  (2 unrouted)
FAULTH+ISO  (1 unrouted)
FAULTH-  (2 unrouted)
FAULTH-ISO  (1 unrouted)
FAULTL+  (2 unrouted)
FAULTL+ISO  (1 unrouted)
FAULTL-  (2 unrouted)
FAULTL-ISO  (1 unrouted)
GATE1  (2 unrouted)
GATE2  (2 unrouted)
GND  (42 unrouted)
  pour Route15 (isolate 0.254): 0,69.85 74.93,69.85 74.93,0 0,0
N$1  (1 unrouted)
N$2  (1 unrouted)
N$3  (1 unrouted)
N$4  (1 unrouted)
N$5  (1 unrouted)
N$6  (1 unrouted)
N$7  (1 unrouted)
N$8  (1 unrouted)
N$9  (1 unrouted)
N$10  (1 unrouted)
N$11  (1 unrouted)
N$12  (1 unrouted)
N$13  (1 unrouted)
N$14  (1 unrouted)
N$15  (1 unrouted)
N$16  (1 unrouted)
N$17  (1 unrouted)
N$18  (1 unrouted)
N$19  (1 unrouted)
N$20  (1 unrouted)
N$21  (1 unrouted)
N$22  (1 unrouted)
N$23  (1 unrouted)
N$24  (1 unrouted)
N$25  (1 unrouted)
N$26  (1 unrouted)
N$27  (1 unrouted)
N$28  (1 unrouted)
N$29  (1 unrouted)
N$30  (1 unrouted)
N$31  (2 unrouted)
N$32  (1 unrouted)
N$33  (1 unrouted)
N$34  (2 unrouted)
N$35  (1 unrouted)
N$36  (1 unrouted)
N$37  (1 unrouted)
N$38  (2 unrouted)
  pour Top (isolate 0.813, no thermals): 50.13,18.54 50.13,42.54 28.13,42.54 28.13,18.54
N$39  (1 unrouted)
N$40  (1 unrouted)
N$41  (2 unrouted)
  pour Top (isolate 0.813, no thermals): 24.13,26.54 24.13,50.54 2.13,50.54 2.13,26.54
N$42  (1 unrouted)
N$43  (1 unrouted)
N$44  (2 unrouted)
N$45  (1 unrouted)
N$46  (2 unrouted)
N$47  (1 unrouted)
N$48  (2 unrouted)
N$49  (2 unrouted)
N$50  (1 unrouted)
N$51  (2 unrouted)
N$52  (2 unrouted)
N$53  (2 unrouted)
N$54  (2 unrouted)
N$55  (2 unrouted)
N$56  (2 unrouted)
N$57  (2 unrouted)
N$58  (2 unrouted)
N$59  (2 unrouted)
N$60  (2 unrouted)
N$61  (2 unrouted)
N$62  (1 unrouted)
N$63  (2 unrouted)
NPNB  (1 unrouted)
ON+  (2 unrouted)
ON-  (2 unrouted)
TEMP13  (2 unrouted)
TEMP14  (2 unrouted)
TOP  (4 unrouted)
TSELECT  (1 unrouted)
TSENSE1  (1 unrouted)
VIO  (8 unrouted)
VP  (5 unrouted)
VSENSE0  (3 unrouted)
VSENSE1  (1 unrouted)
VSENSE2  (1 unrouted)
VSENSE3  (1 unrouted)
VSENSE4  (1 unrouted)
VSENSE5  (1 unrouted)
VSENSE6  (1 unrouted)
VSENSE7  (1 unrouted)
VSENSE8  (1 unrouted)
VSENSE9  (1 unrouted)
VSENSE10  (1 unrouted)
VSENSE11  (1 unrouted)
VSENSE12  (2 unrouted)
VSENSE13  (4 unrouted)
VSENSE14  (7 unrouted)

### Text on the board
tValues: 1-2nF | 10 | 10 | 1-2nF